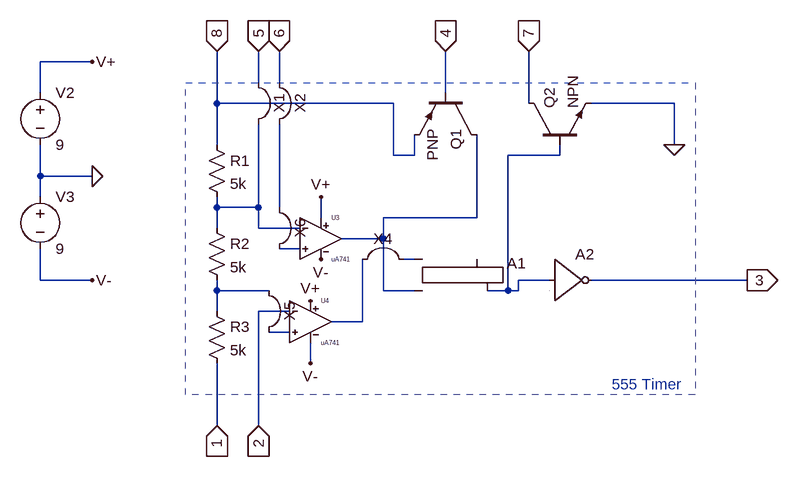
[diagram p0: schematic IC555.asc]
IC555.asc, the LTspice schematic file:
Version 4
SHEET 1 892 708
WIRE -192 -128 -272 -128
WIRE 64 -96 64 -144
WIRE 96 -96 96 -144
WIRE -272 -80 -272 -128
WIRE 352 -80 352 -144
WIRE 0 -64 0 -144
WIRE 272 -64 0 -64
WIRE 480 -64 480 -144
WIRE 704 -64 576 -64
WIRE 0 0 0 -64
WIRE 704 0 704 -64
WIRE 272 16 272 -64
WIRE 304 16 304 -16
WIRE 304 16 272 16
WIRE 528 16 528 0
WIRE 528 16 448 16
WIRE -272 48 -272 0
WIRE -192 48 -272 48
WIRE -272 80 -272 48
WIRE 0 96 0 80
WIRE 64 96 64 -32
WIRE 64 96 0 96
WIRE 96 96 96 -32
WIRE 160 112 160 80
WIRE 400 112 400 -16
WIRE 400 112 256 112
WIRE 0 128 0 96
WIRE 64 128 64 96
WIRE 128 128 64 128
WIRE 256 144 256 112
WIRE 256 144 192 144
WIRE 128 160 96 160
WIRE 304 176 288 176
WIRE -272 208 -272 160
WIRE -192 208 -272 208
WIRE 512 208 464 208
WIRE 816 208 576 208
WIRE 0 224 0 208
WIRE 80 224 0 224
WIRE 256 224 256 144
WIRE 304 224 256 224
WIRE 448 224 448 16
WIRE 448 224 416 224
WIRE 464 224 464 208
WIRE 464 224 448 224
WIRE 0 256 0 224
WIRE 112 256 64 256
WIRE 224 272 224 176
WIRE 224 272 176 272
WIRE 112 288 80 288
WIRE 144 336 144 304
WIRE 0 432 0 336
WIRE 64 432 64 256
FLAG -192 48 0
FLAG -192 -128 V+
FLAG -192 208 V-
FLAG 160 80 V+
FLAG 144 240 V+
FLAG 144 336 V-
FLAG 704 0 0
FLAG 160 176 V-
FLAG 0 -144 8
IOPIN 0 -144 In
FLAG 352 -144 4
IOPIN 352 -144 In
FLAG 480 -144 7
IOPIN 480 -144 In
FLAG 816 208 3
IOPIN 816 208 Out
FLAG 64 432 2
IOPIN 64 432 In
FLAG 0 432 1
IOPIN 0 432 In
FLAG 64 -144 5
IOPIN 64 -144 In
FLAG 96 -144 6
IOPIN 96 -144 In
SYMBOL Digital\\srflop 352 128 R0
SYMATTR InstName A1
SYMBOL Digital\\inv 512 144 R0
SYMATTR InstName A2
SYMBOL res -16 -16 R0
SYMATTR InstName R1
SYMATTR Value 5k
SYMBOL res -16 112 R0
SYMATTR InstName R2
SYMATTR Value 5k
SYMBOL res -16 240 R0
SYMATTR InstName R3
SYMATTR Value 5k
SYMBOL voltage -272 -96 R0
WINDOW 123 0 0 Left 0
WINDOW 39 0 0 Left 0
SYMATTR InstName V2
SYMATTR Value 9
SYMBOL voltage -272 64 R0
WINDOW 123 0 0 Left 0
WINDOW 39 0 0 Left 0
SYMATTR InstName V3
SYMATTR Value 9
SYMBOL pnp 400 -80 R90
SYMATTR InstName Q1
SYMBOL npn 480 0 R270
SYMATTR InstName Q2
SYMBOL Misc\\jumper 256 112 R0
SYMATTR InstName X4
SYMBOL Misc\\jumper 144 256 R90
SYMATTR InstName X5
SYMBOL Misc\\jumper 160 128 R90
SYMATTR InstName X6
SYMBOL Misc\\jumper 128 -64 R90
SYMATTR InstName X1
SYMBOL Misc\\jumper 160 -64 R90
SYMATTR InstName X2
SYMBOL uA741 160 80 R0
SYMATTR InstName U3
SYMBOL uA741 144 208 R0
SYMATTR InstName U4
TEXT 608 368 Left 2 ;555 Timer
RECTANGLE Normal 736 384 -48 -96 2

The netlist it stands for:
* IC555.asc
A1 N003 N002 0 0 0 N001 0 0 SRFLOP
A2 N001 0 0 0 0 3 0 0 BUF
R1 8 5 5k
R2 5 N004 5k
R3 N004 1 5k
V2 V+ 0 9
V3 0 V- 9
Q1 N002 4 8 0 PNP
Q2 7 N001 0 0 NPN
XU3 6 5 V+ V- N002 uA741  ; pins In+ In- V+ V- OUT
XU4 N004 2 V+ V- N003 uA741  ; pins In+ In- V+ V- OUT
.model NPN NPN
.model PNP PNP
.lib standard.bjt
* 555 Timer
.lib OpAmp.lib
.backanno
.end